# EAGLE design IOB-Signal (EAGLE 7.7.0)
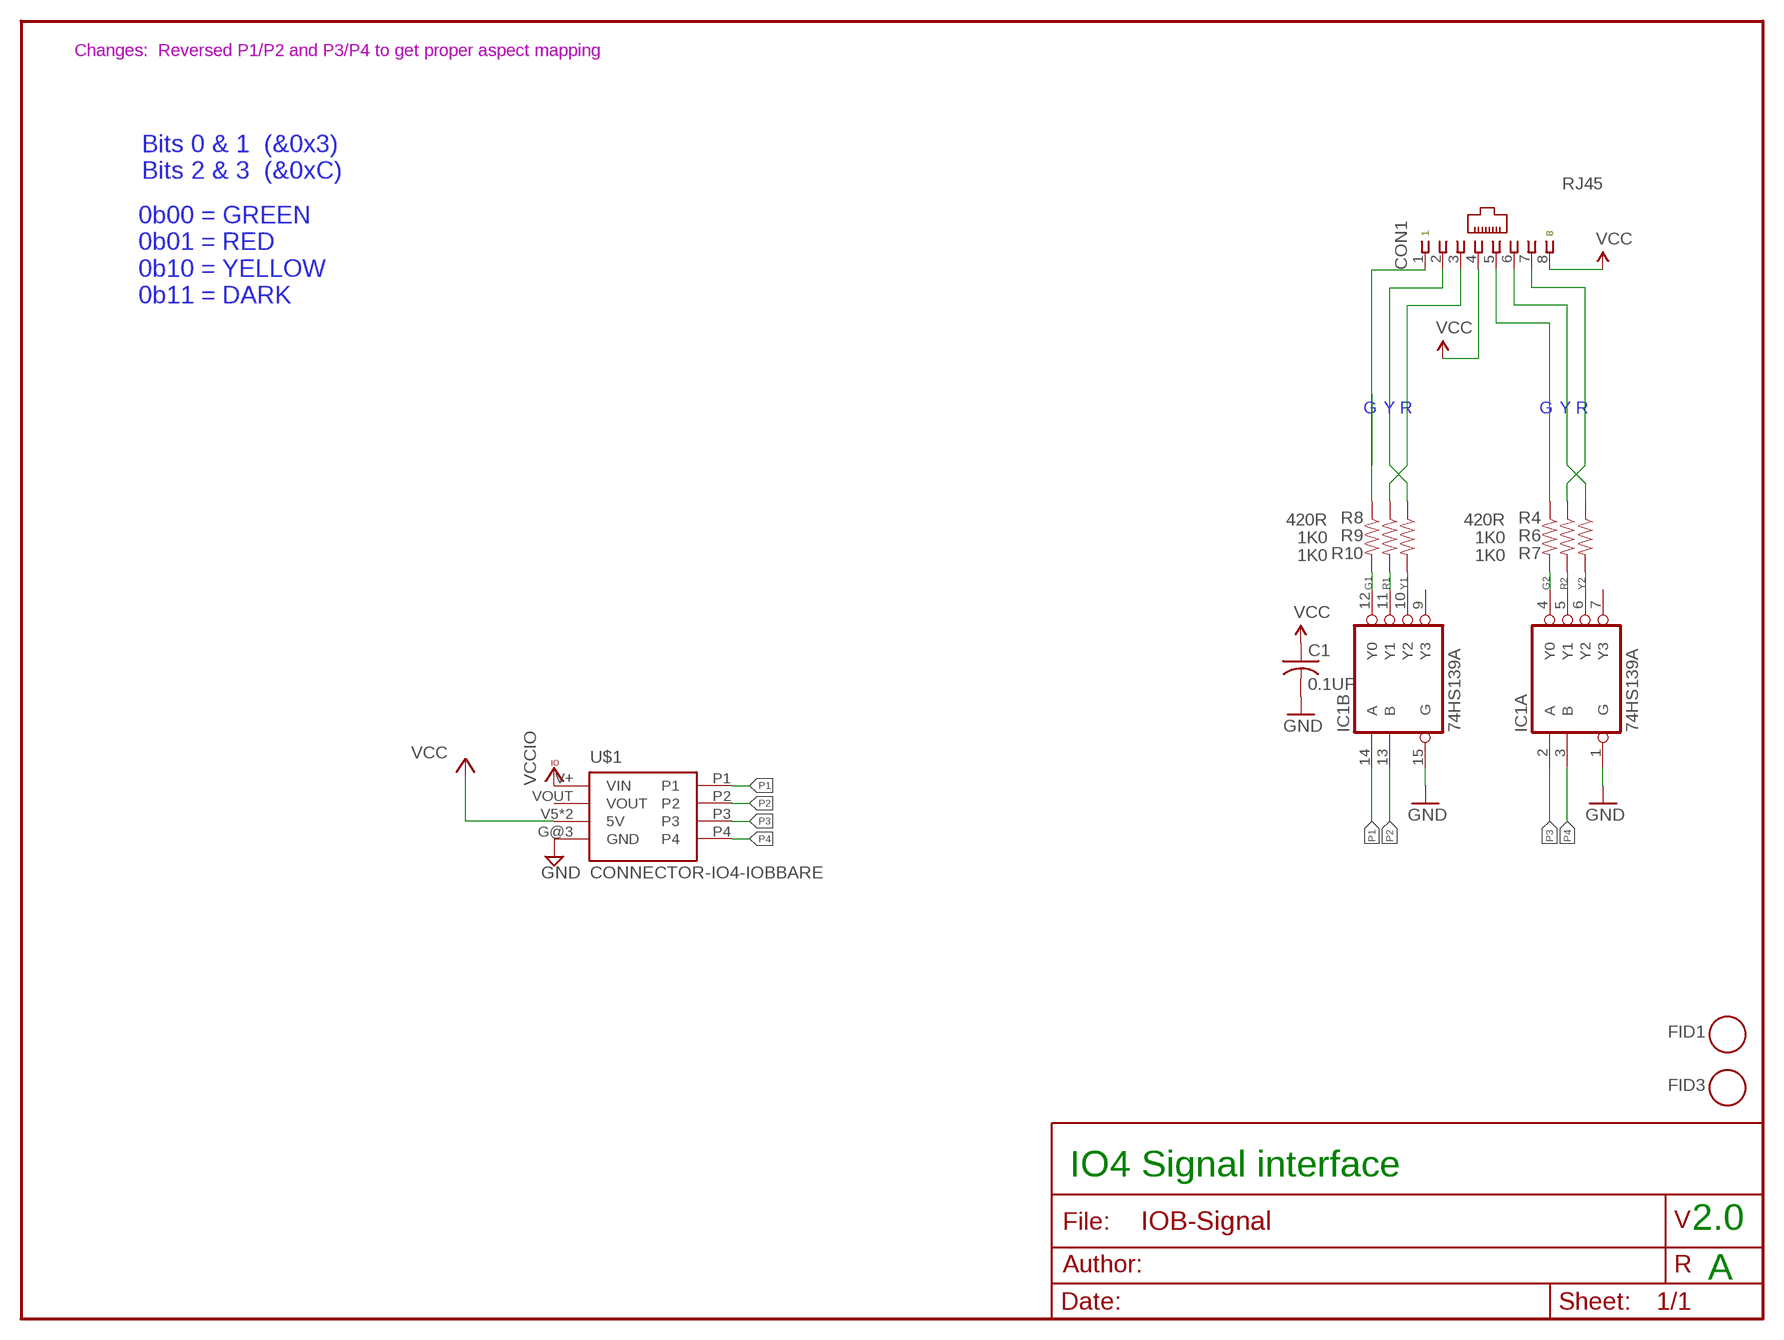
[diagram p0: schematic, sheet 1]

## Parts
C1  0.1UF  CAP0805  [0805-CAP]
CON1  RJ45  CONNECTOR-RJ45-FRONT  [RJ45-NO-SHIELD]
FID1  FIDUCIAL  [FIDUCIAL_1MM]
FID3  FIDUCIAL  [FIDUCIAL_1MM]
IC1  74HS139A  74LS139D  [SO16]
R4  420R  R0805-RES  [0805-RES]
R6  1K0  R0805-RES  [0805-RES]
R7  1K0  R0805-RES  [0805-RES]
R8  420R  R0805-RES  [0805-RES]
R9  1K0  R0805-RES  [0805-RES]
R10  1K0  R0805-RES  [0805-RES]
U$1  CONNECTOR-IO4-IOBBARE  [IO4-IOB]

## Nets
G1: IC1.12(B:Y0) R10.2
G1-LED: CON1.1 R10.1
G2: IC1.4(A:Y0) R7.2
G2-LED: CON1.5 R7.1
GND [Power]: C1.2 IC1.1(A:G) IC1.15(B:G) U$1.G@3(GND)
P1 [signals]: IC1.14(B:A) U$1.P1
P2 [signals]: IC1.13(B:B) U$1.P2
P3 [signals]: IC1.2(A:A) U$1.P3
P4 [signals]: IC1.3(A:B) U$1.P4
R1: IC1.11(B:Y1) R9.2
R1-LED: CON1.3 R9.1
R2: IC1.5(A:Y1) R6.2
R2-LED: CON1.7 R6.1
VCC [Power]: C1.1 CON1.4 CON1.8 U$1.V5(5V) U$1.V5@1(5V)
VCCIO: U$1.V+(VIN)
Y1: IC1.10(B:Y2) R8.2
Y1-LED: CON1.2 R8.1
Y2: IC1.6(A:Y2) R4.2
Y2-LED: CON1.6 R4.1
Unconnected: IC1.7(A:Y3) IC1.9(B:Y3) U$1.VOUT

## Notes on the sheet
- Changes:  Reversed P1/P2 and P3/P4 to get proper aspect mapping
- Bits 0 & 1  (&0x3)
  Bits 2 & 3  (&0xC)
- 0b00 = GREEN
  0b01 = RED
  0b10 = YELLOW
  0b11 = DARK
- G | Y | R | G | Y | R
- IO4 Signal interface
- 2.0
- A

## Power pins joined to a net without a drawn wire
GND: IC1.8(P:GND)
VCC: IC1.16(P:VCC)

## Library data of the parts
C1 = SPCoast:CAP*
CON1 = SPCoast:CONNECTOR-RJ45: Tyco CORCOM Modular RJ Jacks No Shield; AMP: 520151-4; OPL: none
FID1 FID3 = SPCoast:FIDUCIAL: For use by pick and place machines to calibrate the vision/machine, 1mm By microbuilder.eu
IC1 = SPCoast:74*139: Dual 2-line to 4-line DECODER/DEMULTIPLEXER
R4 R6-R10 = SPCoast:R*: Resistor Basic schematic elements and footprints for 0603, 1206, and PTH 1/10th watt (small) resistors.
U$1 = SPCoast:CONNECTOR-IO4-IOB

## Net classes
0 default: width 0.254 mm, drill 0.5 mm
1 Power: width 0.254 mm, drill 0.6 mm
2 signals: width 0.254 mm, drill 0.5 mm

## Board
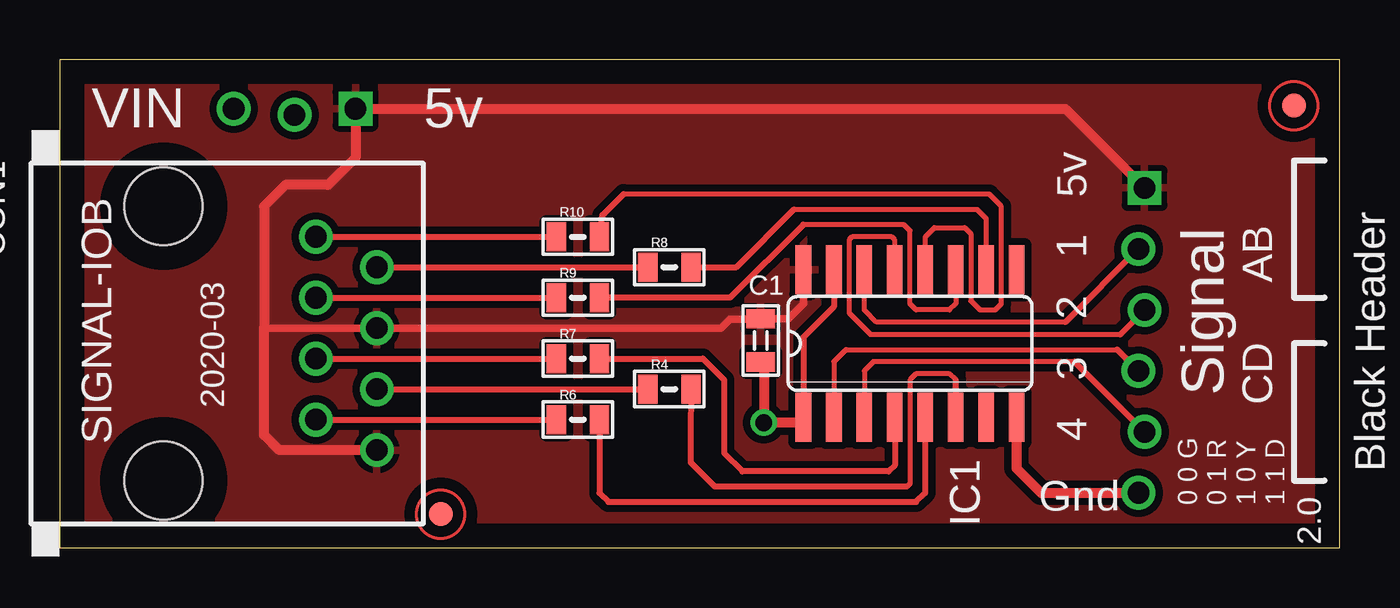
[diagram p1: board, top side]
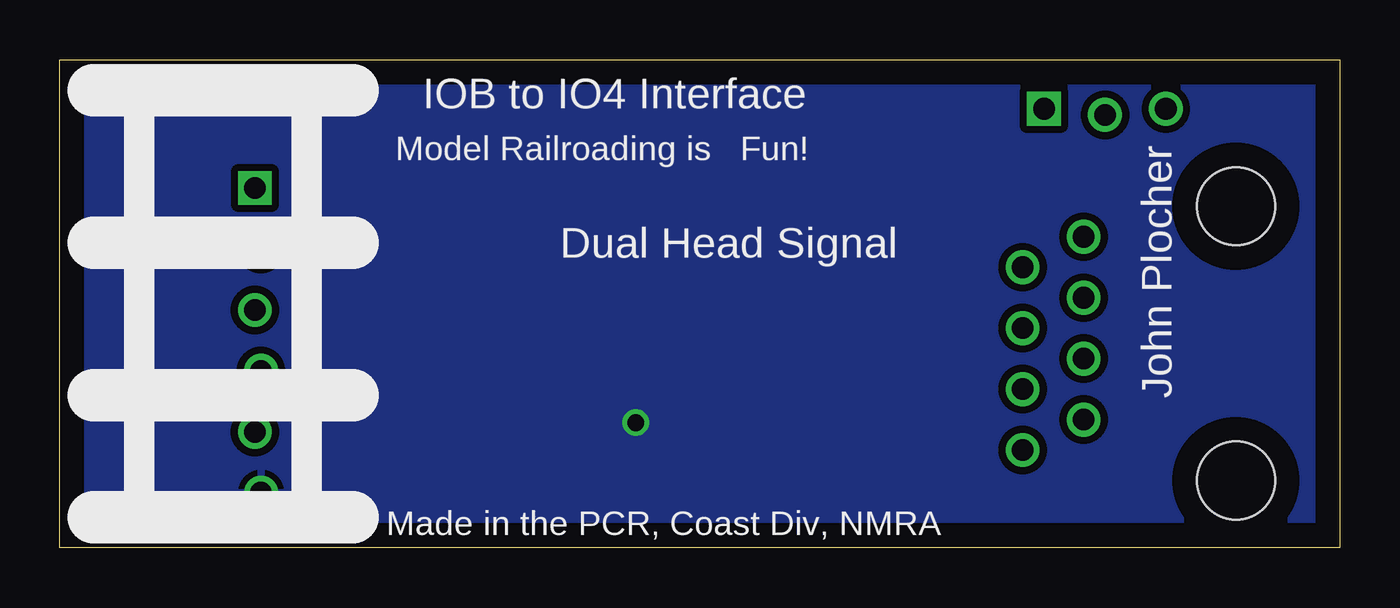
[diagram p2: board, bottom side, seen from below]

Size 53.34 x 20.32 mm. Coordinates in mm from the lower left corner, seen from the top.
Outline: 53.34,0 53.34,20.32 0,20.32 0,0 53.34,0
Copper layers (1*16): Top 0.035mm / dielectric 1.5mm / Bottom 0.035mm
Design rules "default": minimum track width 10mil, minimum drill 24mil, track to track 8mil, track to pad 8mil, pad to pad 8mil, via to via 8mil, smd to smd 8mil, copper to edge 40mil, drill to drill 8mil, minimum pad ring 10mil, minimum via ring 8mil, stop-mask expansion 4mil, vias tented up to drill 0mil, thermal gap 10mil

### Footprints (pad centres in the part's own frame; a part is rotated, then mirrored left to right if it is on the bottom)
0805-CAP = smd 0.8 x 1.2: 1 -0.9,0; 2 0.9,0
RJ45-NO-SHIELD = drill 0.9 pad 1.4: 1 -4.445,6.35; 2 -3.175,8.89; 3 -1.905,6.35; 4 -0.635,8.89; 5 0.635,6.35; 6 1.905,8.89; 7 3.175,6.35; 8 4.445,8.89 | hole 3.251: -5.715,0; 5.715,0
FIDUCIAL_1MM = smd 1 x 1: 1 0,0
SO16 = smd 0.66 x 2.032: 1 -4.445,-3.073; 2 -3.175,-3.073; 3 -1.905,-3.073; 4 -0.635,-3.073; 5 0.635,-3.073; 6 1.905,-3.073; 7 3.175,-3.073; 8 4.445,-3.073; 9 4.445,3.073; 10 3.175,3.073; 11 1.905,3.073; 12 0.635,3.073; 13 -0.635,3.073; 14 -1.905,3.073; 15 -3.175,3.073; 16 -4.445,3.073
0805-RES = smd 0.8 x 1.2: 1 -0.9,0; 2 0.9,0
IO4-IOB = drill 0.9: G@3 44.958,2.286; P1 44.958,12.446; P2 45.212,9.906; P3 44.958,7.366; P4 45.212,4.826; V+ 7.239,18.288; VOUT 9.779,18.034 | drill 0.9 square: V5 12.319,18.288; V5@1 45.212,14.986

### Placement (x,y rotation side)
C1  29.21,8.64 270 top
CON1  4.32,8.51 270 top
FID1  15.88,1.4 0 top
FID3  51.44,18.41 0 top
IC1  35.43,8.51 0 top
R4  25.4,6.6 0 top
R6  21.59,5.33 0 top
R7  21.59,7.87 0 top
R8  25.4,11.68 0 top
R9  21.59,10.41 0 top
R10  21.59,12.95 0 top
U$1  0,0 0 top

### Tracks (layer width: path | path; a pad name or v marks a point on that pad's centre or on a via)
G1
  Top 0.203: IC1.12 36.07,12.95 36.45,13.34 37.72,13.34 37.97,13.08 37.97,10.29 38.35,9.91 38.99,9.91 39.24,10.16 39.24,14.22 38.73,14.73 23.5,14.73
  Top 0.254: R10.2 22.62,13.85 23.5,14.73
G1-LED
  Top 0.254: CON1.1 R10.1
G2
  Top 0.254: R7.2 26.8,7.87 27.69,6.99 27.69,3.94 28.45,3.17 34.54,3.17 34.8,3.43 IC1.4
G2-LED
  Top 0.254: CON1.5 R7.1
GND  (via drill 0.7)
  Top 0.254: IC1.15 32.26,10.03 30.99,8.76 IC1.1 | C1.2
  Top 0.406: IC1.8 39.88,3.3 40.89,2.29 U$1.G@3 | C1.2 29.34,7.63 v29.34,5.21 30.76,5.21 IC1.1
  pour Bottom (isolate 0.305): 0,0 0,20.32 53.34,20.32 53.34,0
P1
  Top 0.203: 41.91,9.4 34.04,9.4 33.53,9.91 IC1.14
  Top 0.254: 41.91,9.4 U$1.P1
P2
  Top 0.203: 44.2,8.89 33.78,8.89 32.89,9.78 32.89,12.83 33.02,12.95 34.67,12.95 34.8,12.83 IC1.13
  Top 0.254: 44.2,8.89 U$1.P2
P3
  Top 0.203: 44.07,8.26 32.77,8.26 32.26,7.75 IC1.2
  Top 0.254: 44.07,8.26 U$1.P3
P4
  Top 0.203: 42.29,7.75 33.91,7.75 33.53,7.37 IC1.3
  Top 0.254: 42.29,7.75 U$1.P4
R1
  Top 0.203: IC1.11 37.34,10.16 37.08,9.91 35.69,9.91 35.43,10.16 35.43,13.21 35.18,13.46 30.99,13.46
  Top 0.254: R9.2 27.94,10.41 30.99,13.46
R1-LED
  Top 0.254: CON1.3 R9.1
R2
  Top 0.254: R6.2 22.49,2.27 22.86,1.91 35.69,1.91 36.07,2.29 IC1.5
R2-LED
  Top 0.254: CON1.7 R6.1
VCC
  Top 0.305: IC1.16 30.99,10.16 30.36,9.54 C1.1 29.2,9.53 27.94,9.53 27.56,9.14 CON1.4 8.51,9.14
  Top 0.406: CON1.8 9.14,4.06 8.51,4.7 8.51,9.14 8.51,14.22 9.4,15.11 11.18,15.11 12.32,16.26 U$1.V5 41.91,18.29 U$1.V5@1
  pour Top (isolate 0.305): 0,0 0,20.32 53.34,20.32 53.34,0
Y1
  Top 0.203: 30.61,14.1 38.23,14.1 38.61,13.72 IC1.10
  Top 0.254: R8.2 28.19,11.68 30.61,14.1
Y1-LED
  Top 0.254: CON1.2 R8.1
Y2
  Top 0.203: 37.34,6.99 37.08,7.24 35.69,7.24 35.43,6.99 35.43,2.67 35.31,2.54
  Top 0.254: R4.2 26.29,4.69 26.29,3.56 27.3,2.54 35.31,2.54 | IC1.6 37.34,6.99
Y2-LED
  Top 0.254: CON1.6 R4.1

### Text on the board
tPlace: AB | 2020-03 | Signal | CD | SIGNAL-IOB | Black Soldermask / White Silkscreen | Black Header | 0 0 G / 0 1 R / 1 0 Y / 1 1 D | 2.0
bPlace: John Plocher | Dual Head Signal
_tNames: CON1 | R10 | R8 | R9 | C1 | R7 | R4 | R6 | IC1